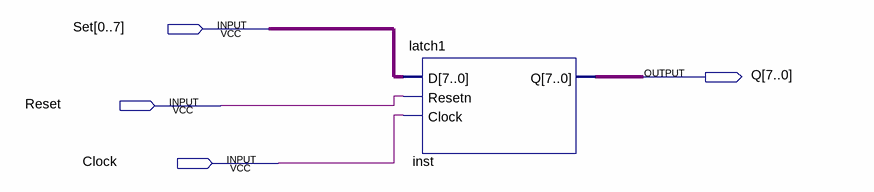
[diagram p0: schematic sheet]
// Quartus schematic Latchtest.bdf as structural Verilog: 1 symbols, 4 pins
module Latchtest (
  input  [0:7] Set,
  input  Reset,
  input  Clock,
  output [7:0] Q
);

  latch1 inst (.D(Set), .Resetn(Reset), .Clock(Clock), .Q(Q));
endmodule
